# EAGLE design Schametics (EAGLE 9.6.2)
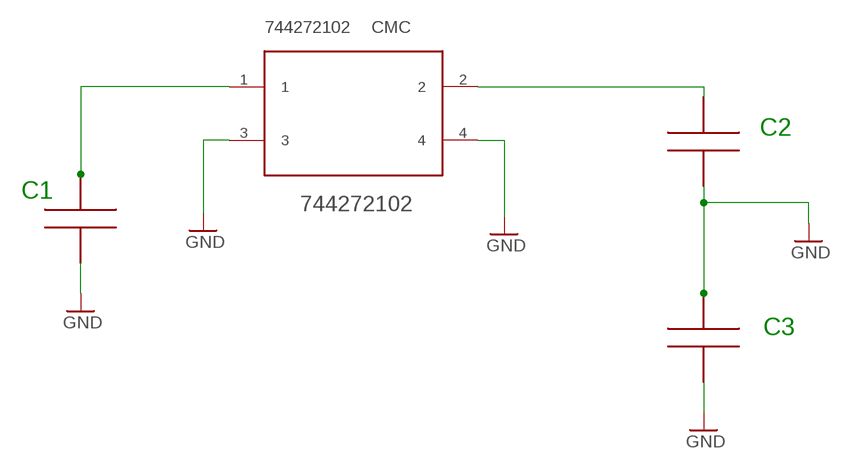
[diagram p0: schematic, sheet 1]

## Parts
744272102  CHOKE  [CHOKE]
U$1  1500pF  CAPA1210  [FGJGFN]
U$2  CAPA1210  [FGJGFN]
U$3  CAPA1210  [FGJGFN]

## Nets
GND: 744272102.3 744272102.4 U$1.1 U$2.1 U$3.1 U$3.2
N$1: 744272102.1 U$1.2
N$2: 744272102.2 U$2.2

## Notes on the sheet
- C2
- C1=1500pF
- C1
- C3

## Library data of the parts
744272102 = CHOKE:CHOKE
U$1-U$3 = capa:CAPA

## Board
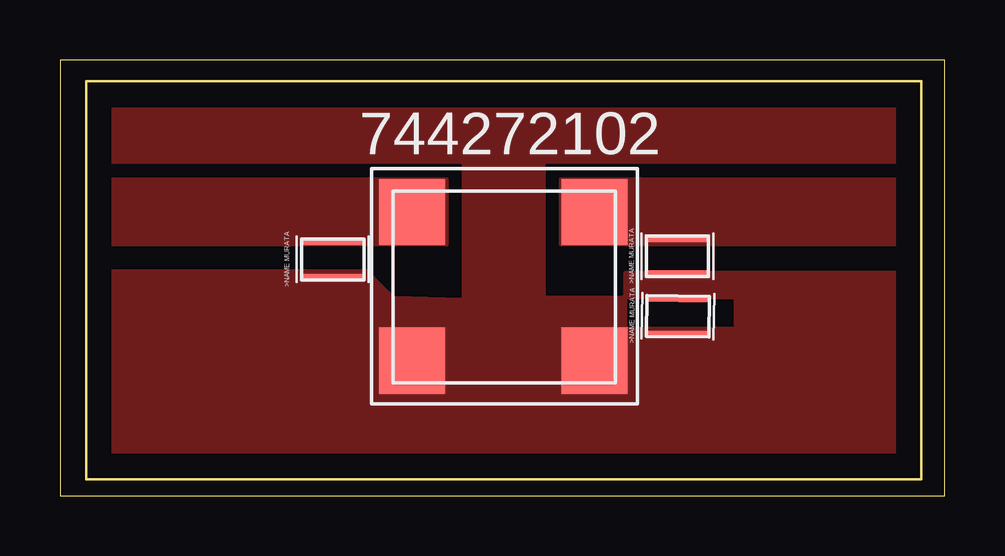
[diagram p1: board, top side]

Size 36.89 x 18.18 mm. Coordinates in mm from the lower left corner, seen from the top.
Outline: 0,0 36.89,0 36.89,18.18 0,18.18 0,0
Outline: 1.1,17.3 35.9,17.3 35.9,0.7 1.1,0.7 1.1,17.3
Copper layers (1*16): Top 0.035mm / dielectric 1.5mm / Bottom 0.035mm
Design rules "default": minimum track width 6mil, minimum drill 0.35mm, track to track 6mil, track to pad 6mil, pad to pad 6mil, via to via 6mil, smd to smd 6mil, copper to edge 40mil, drill to drill 6mil, minimum pad ring 10mil, minimum via ring 8mil, stop-mask expansion 4mil, vias tented up to drill 0mil, thermal gap 10mil

### Footprints (pad centres in the part's own frame; a part is rotated, then mirrored left to right if it is on the bottom)
CHOKE = smd 2.76 x 2.76: 1 -3.79,2.54; 2 3.81,2.54; 3 3.81,-3.66; 4 -3.79,-3.66
FGJGFN = smd 0.3 x 2.7: 1 -0.8,0; 2 0.7,0

### Placement (x,y rotation side)
744272102  18.47,9.3 0 top
U$1  11.37,9.91 90 top
U$2  25.74,10.04 90 top
U$3  25.76,7.54 89.3 top

### Tracks (layer width: path | path; a pad name or v marks a point on that pad's centre or on a via)
GND
  pour Top (no thermals): 1.5,9.4 12.8,9.4 13.9,8.3 16.8,8.21 16.8,13.9 1.5,13.9 1.5,16.5 35.5,16.5 35.5,13.9 20.2,13.9 20.2,8.3 23.6,8.3 23.6,7 35.4,7 35.4,1.2 1.5,1.2
  pour Top (no thermals): 23.6,8.3 23.6,9.3 35.4,9.3 35.4,7.1 28.2,7.1 28.2,8.3
N$1
  pour Top (no thermals): 1.6,13.2 16.1,13.2 16.1,10.5 1.6,10.5
N$2
  pour Top (no thermals): 20.9,13.2 35.4,13.2 35.4,10.5 20.9,10.5